# EAGLE design Linkable_LED_Matrix (EAGLE 7.0.0)
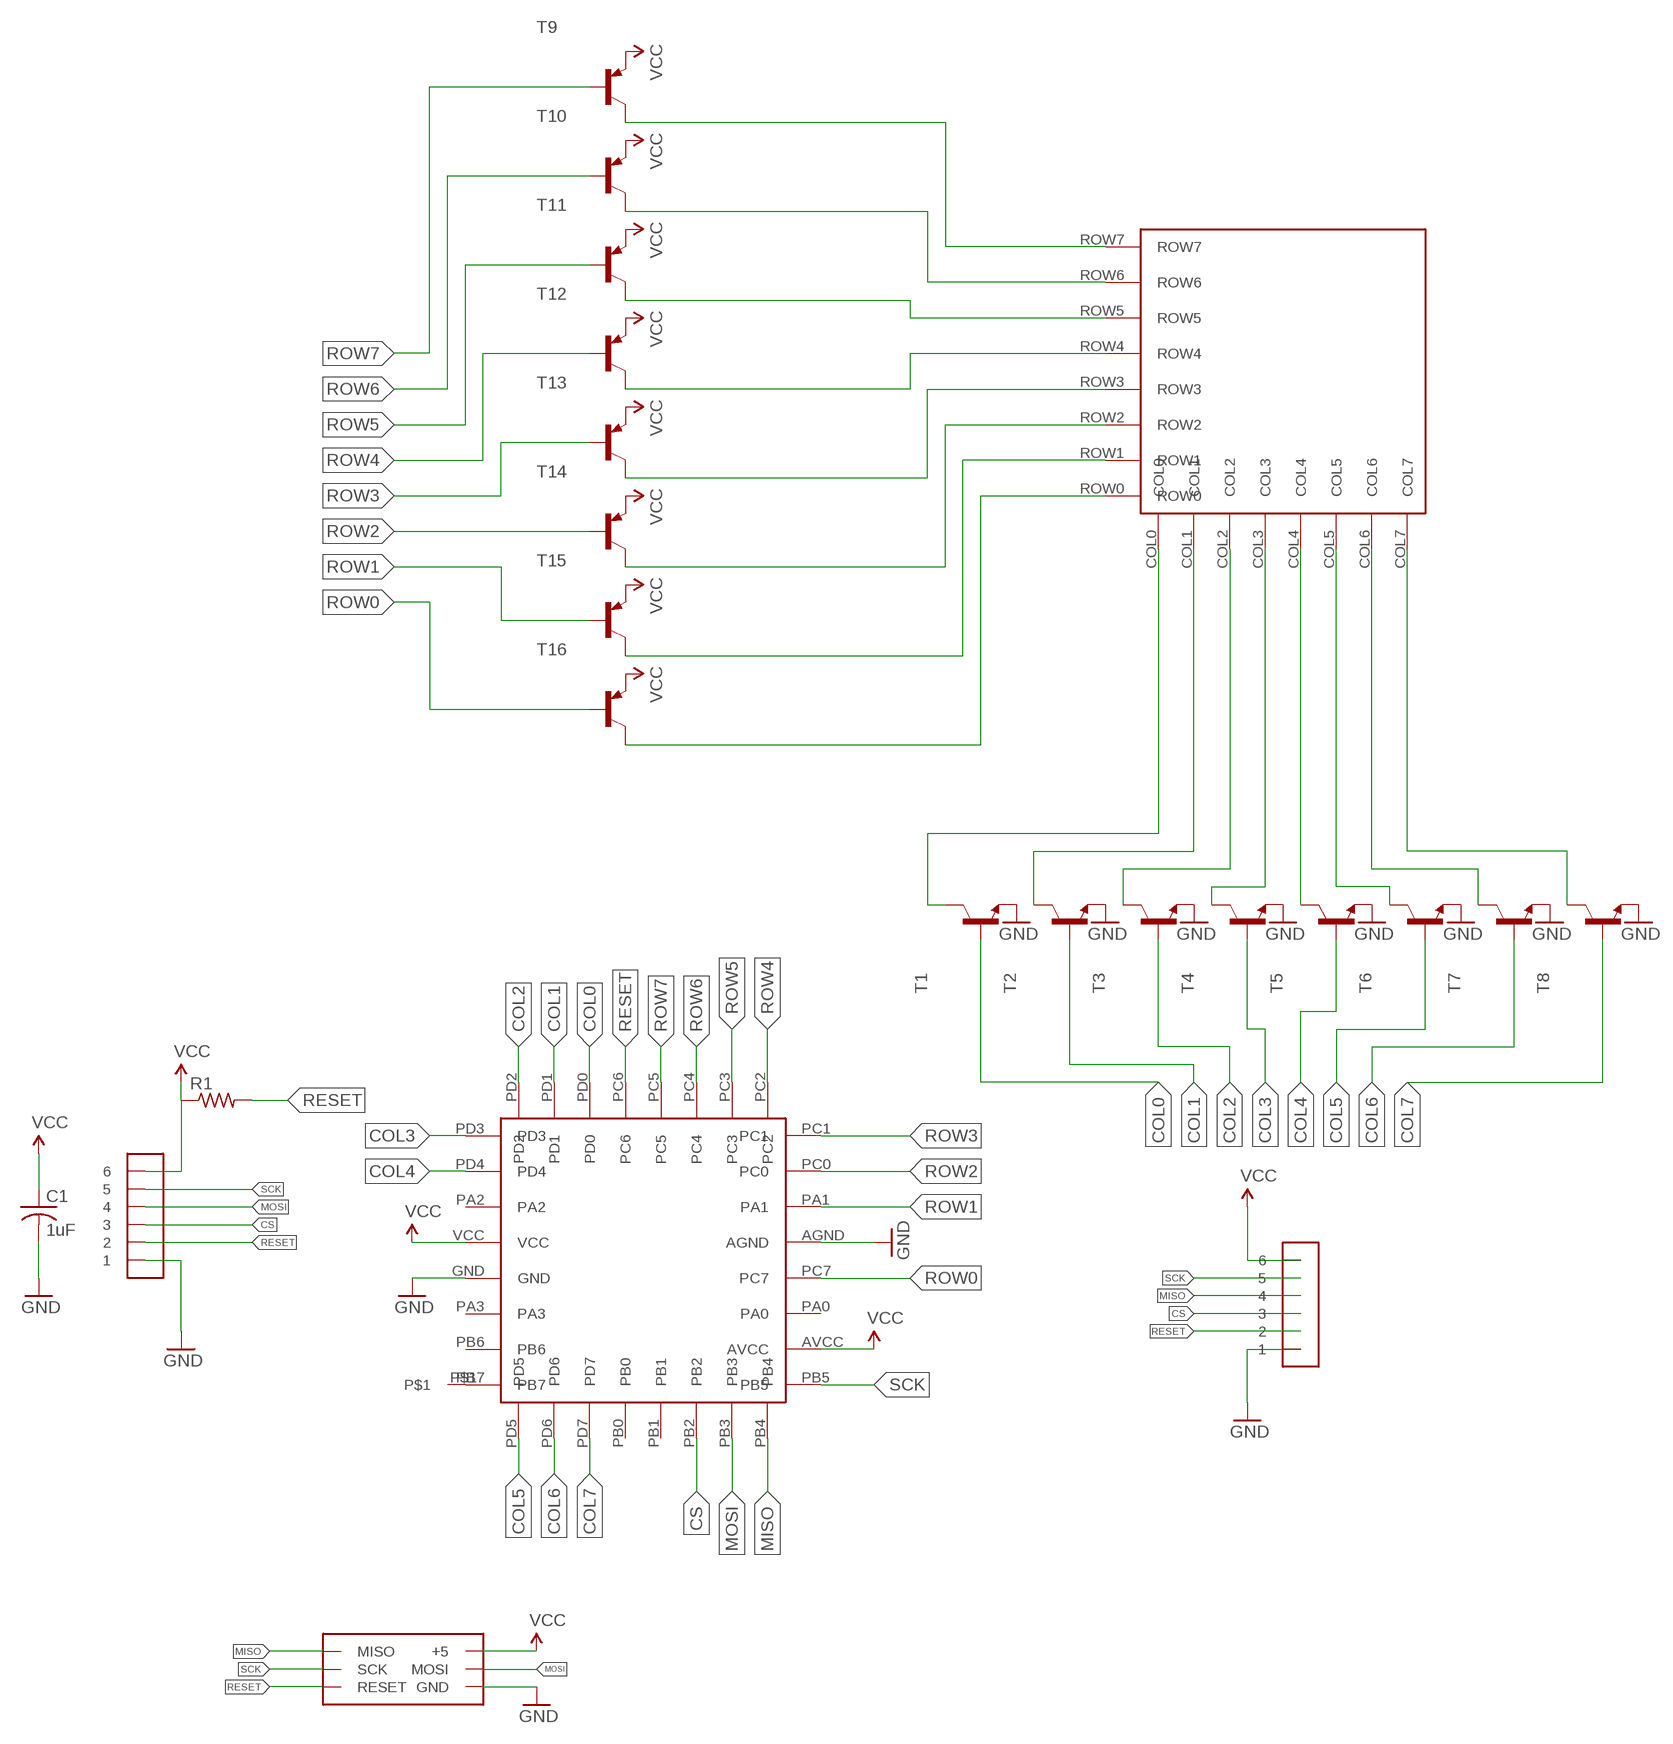
[diagram p0: schematic, sheet 1]

## Parts
C1  1uF  C-USC0603  [C0603]
R1  R-US_R0603  [R0603]
T1  MMBT2222ALT1-NPN-SOT23-BEC  [SOT23-BEC]
T2  MMBT2222ALT1-NPN-SOT23-BEC  [SOT23-BEC]
T3  MMBT2222ALT1-NPN-SOT23-BEC  [SOT23-BEC]
T4  MMBT2222ALT1-NPN-SOT23-BEC  [SOT23-BEC]
T5  MMBT2222ALT1-NPN-SOT23-BEC  [SOT23-BEC]
T6  MMBT2222ALT1-NPN-SOT23-BEC  [SOT23-BEC]
T7  MMBT2222ALT1-NPN-SOT23-BEC  [SOT23-BEC]
T8  MMBT2222ALT1-NPN-SOT23-BEC  [SOT23-BEC]
T9  MMBT3906LT1-PNP-SOT23-BEC  [SOT23-BEC]
T10  MMBT3906LT1-PNP-SOT23-BEC  [SOT23-BEC]
T11  MMBT3906LT1-PNP-SOT23-BEC  [SOT23-BEC]
T12  MMBT3906LT1-PNP-SOT23-BEC  [SOT23-BEC]
T13  MMBT3906LT1-PNP-SOT23-BEC  [SOT23-BEC]
T14  MMBT3906LT1-PNP-SOT23-BEC  [SOT23-BEC]
T15  MMBT3906LT1-PNP-SOT23-BEC  [SOT23-BEC]
T16  MMBT3906LT1-PNP-SOT23-BEC  [SOT23-BEC]
U$1  ATTINY48  [ATTINY48]
U$3  8X8_LED_MATRIX  [8X8_LED_MATRIX]
U$5  1X1MM_PAD  [1X1MM_PAD]
U$6  DIP1X6MALE  [DIP1X6MALE]
U$7  DIP1X6MALE  [DIP1X6MALE]
U$9  DIP2X3MALE  [DIP2X3MALE]

## Nets
COL0: T1.B U$1.PD0
COL1: T2.B U$1.PD1
COL2: T3.B U$1.PD2
COL3: T4.B U$1.PD3
COL4: T5.B U$1.PD4
COL5: T6.B U$1.PD5
COL6: T7.B U$1.PD6
COL7: T8.B U$1.PD7
CS: U$1.PB2 U$6.3 U$7.3
GND: C1.2 T1.E T2.E T3.E T4.E T5.E T6.E T7.E T8.E U$1.AGND U$1.GND U$6.1 U$7.1 U$9.GND
MISO: U$1.PB4 U$7.4 U$9.MISO
MOSI: U$1.PB3 U$6.4 U$9.MOSI
N$1: T1.C U$3.COL0
N$3: T3.C U$3.COL2
N$4: T4.C U$3.COL3
N$5: T5.C U$3.COL4
N$6: T6.C U$3.COL5
N$7: T7.C U$3.COL6
N$8: T8.C U$3.COL7
N$13: U$1.PB7 U$5.P$1
N$20: T2.C U$3.COL1
N$25: T9.C U$3.ROW7
N$26: T10.C U$3.ROW6
N$27: T11.C U$3.ROW5
N$28: T12.C U$3.ROW4
N$29: T13.C U$3.ROW3
N$30: T14.C U$3.ROW2
N$31: T15.C U$3.ROW1
N$32: T16.C U$3.ROW0
RESET: R1.2 U$1.PC6 U$6.2 U$7.2 U$9.RESET
ROW0: T16.B U$1.PC7
ROW1: T15.B U$1.PA1
ROW2: T14.B U$1.PC0
ROW3: T13.B U$1.PC1
ROW4: T12.B U$1.PC2
ROW5: T11.B U$1.PC3
ROW6: T10.B U$1.PC4
ROW7: T9.B U$1.PC5
SCK: U$1.PB5 U$6.5 U$7.5 U$9.SCK
VCC: C1.1 R1.1 T9.E T10.E T11.E T12.E T13.E T14.E T15.E T16.E U$1.AVCC U$1.VCC U$6.6 U$7.6 U$9.5V(+5)
Unconnected: U$1.PA0 U$1.PA2 U$1.PA3 U$1.PB0 U$1.PB1 U$1.PB6

## Library data of the parts
C1 = resistor:C-US: CAPACITOR, American symbol
R1 = resistor:R-US_: RESISTOR, American symbol
T1-T8 = transistor:*-NPN-: NPN Transistror BF959 corrected 2008.03.06
T9-T16 = transistor:*-PNP-: PNP Transistror
U$1 = ScottSilver:ATTINY48
U$3 = ScottSilver:8X8_LED_MATRIX
U$5 = ScottSilver:1X1MM_PAD
U$6 U$7 = ScottSilver:DIP1X6MALE
U$9 = ScottSilver:DIP2X3MALE

## Board
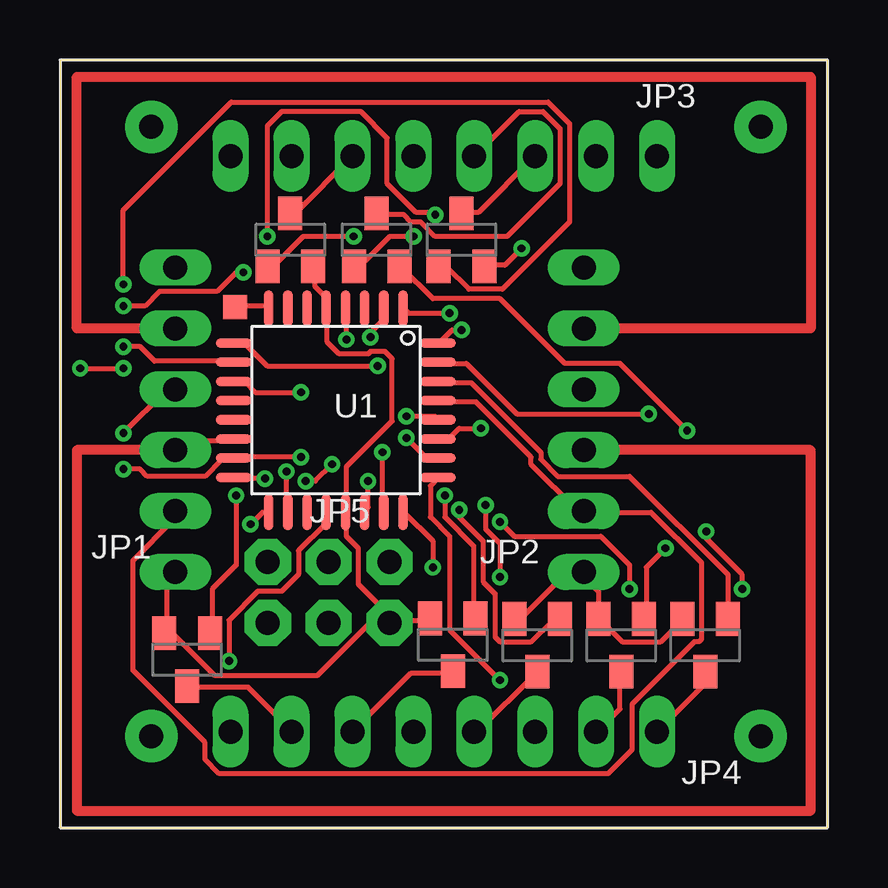
[diagram p1: board, top side]
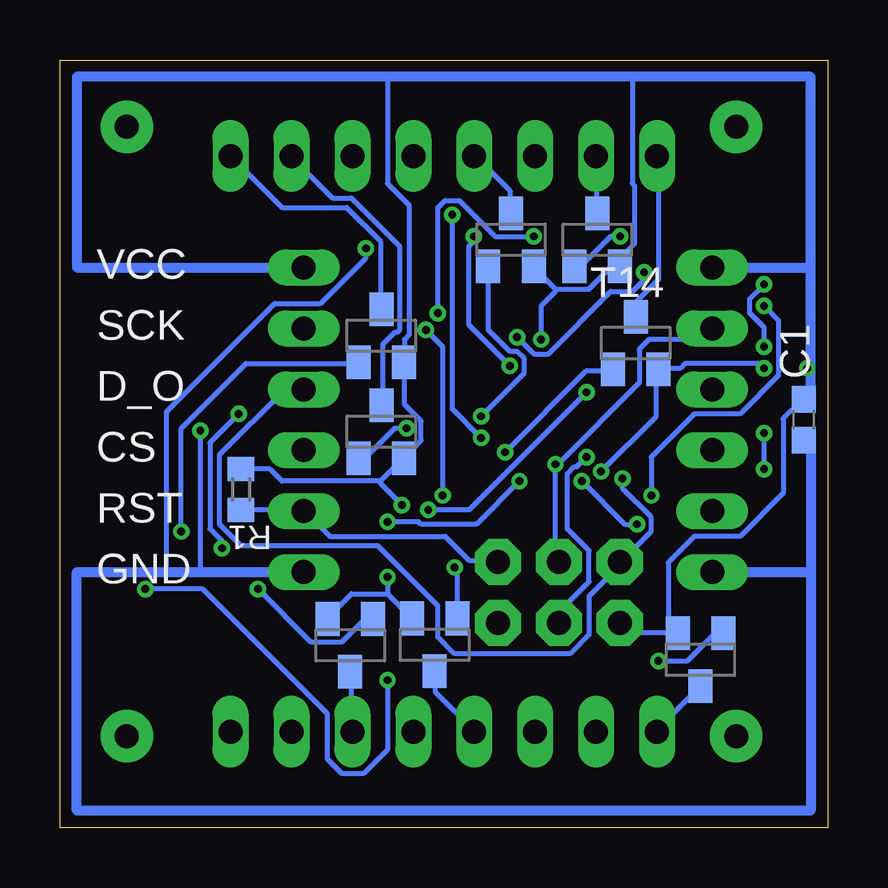
[diagram p2: board, bottom side, seen from below]

Size 32 x 32 mm. Coordinates in mm from the lower left corner, seen from the top.
Outline: 0,0 32,0 32,32 0,32 0,0
Copper layers (1*16): Top 0.0356mm / dielectric 1.5011mm / Bottom 0.0356mm
Design rules "LaenPCBOrder *": minimum track width 8mil, minimum drill 13mil, track to track 6mil, track to pad 6mil, pad to pad 6mil, via to via 6mil, smd to smd 6mil, copper to edge 15mil, drill to drill 6mil, minimum pad ring 7mil, minimum via ring 7mil, stop-mask expansion 3mil, vias tented up to drill 0mil, thermal gap 10mil
vRestrict: area 6.2,26.4 to 25.7,29.6; area 6.2,2.5 to 25.8,5.6; area 20.4,9.8 to 23.3,24.1; area 7.2,7.3 to 15.2,12.3; area 3,9 to 7,25

### Footprints (pad centres in the part's own frame; a part is rotated, then mirrored left to right if it is on the bottom)
C0603 = smd 1.1 x 1: 1 -0.85,0; 2 0.85,0
R0603 = smd 1 x 1.1: 1 -0.85,0; 2 0.85,0
SOT23-BEC = smd 1 x 1.4: B -0.95,-1.1; C 0,1.1; E 0.95,-1.1
ATTINY48 = smd 1.5 x 0.406: AGND 4.25,0.4; AVCC 4.25,-2; GND -4.25,-0.4; PA0 4.25,-1.2; PA1 4.25,1.2; PA2 -4.25,1.2; PA3 -4.25,-1.2; PB5 4.25,-2.8; PB6 -4.25,-2; PB7 -4.25,-2.8; PC0 4.25,2; PC1 4.25,2.8; PC7 4.25,-0.4; PD3 -4.25,2.8; PD4 -4.25,2; VCC -4.25,0.4 | smd 0.406 x 1.5: PB0 -0.4,-4.25; PB1 0.4,-4.25; PB2 1.2,-4.25; PB3 2,-4.25; PB4 2.8,-4.25; PC2 2.8,4.25; PC3 2,4.25; PC4 1.2,4.25; PC5 0.4,4.25; PC6 -0.4,4.25; PD0 -1.2,4.25; PD1 -2,4.25; PD2 -2.8,4.25; PD5 -2.8,-4.25; PD6 -2,-4.25; PD7 -1.2,-4.25
8X8_LED_MATRIX = drill 1 long: COL0 8.89,-12; COL1 6.35,-12; COL2 -3.81,-12; COL3 -3.81,12; COL4 -6.35,-12; COL5 1.27,12; COL6 3.81,12; COL7 1.27,-12; ROW0 -8.89,-12; ROW1 3.81,-12; ROW2 -8.89,12; ROW3 -1.27,-12; ROW4 8.89,12; ROW5 -6.35,12; ROW6 6.35,12; ROW7 -1.27,12
1X1MM_PAD = smd 1 x 1: P$1 0,0
DIP1X6MALE = drill 1 long: 1 -6.35,0; 2 -3.81,0; 3 -1.27,0; 4 1.27,0; 5 3.81,0; 6 6.35,0
DIP2X3MALE = drill 1 pad 1.93 octagon: 5V -2.54,1.27; GND 2.54,1.27; MISO -2.54,-1.27; MOSI 0,1.27; RESET 2.54,-1.27; SCK 0,-1.27

### Placement (x,y rotation side)
C1  1,17 270 bottom
R1  24.45,14.1 270 bottom
T1  26.9,7.6 180 top
T2  23.4,7.6 180 top
T3  16.38,7.62 180 top
T4  9.6,24.5 0 top
T5  5.3,7 180 top
T6  13.2,24.5 0 top
T7  16.74,24.5 0 top
T8  19.9,7.6 180 top
T9  13.2,24.5 0 bottom
T10  18.6,16.5 0 bottom
T11  9.6,24.5 0 bottom
T12  18.6,20.5 0 bottom
T13  16.38,7.62 180 bottom
T14  8,20.2 0 bottom
T15  19.9,7.6 180 bottom
T16  5.3,7 180 bottom
U$1  11.5,17.4 270 top
U$3  16,16 0 top
U$5  7.3,21.7 0 top
U$6  4.81,17 90 top
U$7  21.84,17 90 top
U$9  11.2,9.8 180 bottom

### Tracks (layer width: path | path; a pad name or v marks a point on that pad's centre or on a via)
COL0
  Top 0.203: T1.B 27.84,8.74 27.84,10.54 23.74,14.64 20.74,14.64 20.04,15.34 20.04,15.64 17.14,18.54 15.84,18.54 U$1.PD0
COL1  (via drill 0.33)
  Top 0.203: v25.24,11.64 24.44,10.84 24.44,8.74 T2.B | v24.54,17.24 19.04,17.24 16.94,19.34 15.84,19.34 U$1.PD1
  Bottom 0.203: v25.24,11.64 25.24,11.94 25.74,12.44 25.74,16.04 v24.54,17.24
COL2  (via drill 0.33)
  Top 0.203: v16.04,13.84 16.04,12.94 17.24,11.74 17.24,8.74 T3.B | v16.74,20.74 16.34,20.74 15.84,20.24 U$1.PD2
  Bottom 0.203: v16.04,13.84 16.04,20.04 v16.74,20.74
COL3  (via drill 0.33)
  Top 0.203: v12.24,24.64 10.14,24.64 8.94,23.44 8.74,23.44 T4.B | v16.24,21.44 14.54,21.44 14.34,21.64 U$1.PD3
  Bottom 0.203: v12.24,24.64 13.84,24.64 15.34,26.14 15.94,26.14 16.24,25.84 v16.24,21.44
COL4  (via drill 0.33)
  Top 0.203: v7.34,13.84 7.34,10.94 6.34,9.94 6.34,8.14 T5.B | v2.64,21.74 3.54,21.74 4.14,22.34 6.54,22.34 7.34,23.14 v7.64,23.14 | v12.94,20.44 12.94,20.64 13.44,21.14 13.44,21.64 U$1.PD4
  Bottom 0.203: v7.34,13.84 7.34,15.44 5.54,17.24 3.64,17.24 2.04,18.84 2.04,21.14 v2.64,21.74 | v7.64,23.14 7.64,22.84 8.14,22.34 9.04,22.34 11.64,19.74 12.24,19.74 v12.94,20.44
COL5  (via drill 0.33)
  Top 0.203: v14.74,24.64 13.74,24.64 12.54,23.44 12.34,23.44 T6.B | v13.24,19.24 8.64,19.24 7.74,20.14 7.34,20.14 U$1.PD5
  Bottom 0.203: v14.74,24.64 14.74,24.44 14.94,24.24 14.94,20.94 v13.24,19.24
COL6  (via drill 0.33)
  Top 0.203: v2.64,22.64 2.64,25.74 7.14,30.24 20.34,30.24 21.24,29.34 21.24,25.24 18.44,22.44 17.04,22.44 16.14,23.34 15.84,23.34 T7.B | v2.64,20.04 3.34,20.04 3.94,19.44 7.24,19.44 U$1.PD6
  Bottom 0.203: v2.64,22.64 3.24,22.04 3.24,21.44 2.64,20.84 v2.64,20.04
COL7  (via drill 0.33)
  Top 0.203: v16.64,13.24 16.64,12.94 17.64,11.94 17.64,10.24 18.14,9.74 18.14,7.94 18.34,7.74 19.64,7.74 20.54,8.64 20.84,8.64 T8.B | v10.04,18.14 8.14,18.14 7.74,18.54 7.34,18.54 U$1.PD7
  Bottom 0.203: v16.64,13.24 14.94,13.24 v10.04,18.14
CS
  Top 0.203: U$1.PB2 7.24,16.14 5.24,16.14 4.94,15.84 U$6.3
  Top 0.406: U$6.3 0.7,15.73 0.7,0.7 31.3,0.7 31.3,15.73 U$7.3
GND  (via drill 0.33)
  Top 0.203: T4.E 10.64,23.34 10.64,22.54 11.04,22.14 11.04,21.74 U$1.GND 11.14,21.64 11.14,20.24 11.64,19.74 12.84,19.74 12.94,19.84 13.54,19.84 13.84,19.54 13.84,16.94 11.94,15.04 11.94,13.24 U$1.AGND 11.94,13.14 11.94,12.14 12.44,11.64 12.44,10.14 13.84,8.74 U$9.GND | T3.E 15.34,8.64 13.84,8.64 13.74,8.54 U$9.GND | U$6.1 4.74,10.64 4.44,10.34 4.44,8.14 T5.E 4.54,8.24 6.44,6.34 10.74,6.34 12.84,8.44 13.64,8.44 U$9.GND | T8.E 19.04,8.74 19.24,8.74 21.14,10.64 21.74,10.64 U$7.1 21.74,10.54 22.44,9.84 22.44,8.74 T2.E 22.54,8.64 23.44,7.74 25.04,7.74 25.94,8.64 T1.E | v26.14,16.54 23.34,19.34 21.04,19.34 18.34,22.04 15.54,22.04 14.24,23.34 T6.E | v19.24,24.14 18.54,23.44 17.74,23.44 T7.E
  Bottom 0.203: 26.14,10.65 v26.14,16.54 | v19.24,24.14 19.24,23.74 21.14,21.84 23.04,21.84 27.54,17.34 27.54,10.65
  Bottom 0.406: U$6.1 0.7,10.65 | 0.7,10.65 0.7,0.7 31.3,0.7 31.3,10.65 27.54,10.65 26.14,10.65 U$7.1 | C1.2 arc90 0.7,15.85 0.7,10.65
MISO  (via drill 0.33)
  Top 0.203: v8.54,14.54 7.34,14.54 U$1.PB4
  Bottom 0.203: v8.54,14.54 8.54,14.14 7.34,12.94 7.34,12.34 8.64,11.04 U$9.MISO 8.64,10.94 9.94,9.64 9.94,8.04 10.74,7.24 15.54,7.24 16.24,7.94 16.24,9.24 18.74,11.74 24.44,11.74 25.34,12.64 25.34,15.54 22.64,18.24 21.84,18.24 U$7.4
MOSI  (via drill 0.33)
  Top 0.203: v10.04,15.44 7.34,15.44 U$1.PB3 7.24,15.34 6.74,15.34 6.04,14.64 3.64,14.64 3.34,14.94 v2.64,14.94 | v2.64,16.44 4.44,18.24 4.74,18.24 U$6.4
  Bottom 0.203: v10.04,15.44 10.44,15.04 10.54,15.04 10.84,14.74 10.84,12.44 9.94,11.54 9.94,10.24 11.14,9.04 11.14,8.54 U$9.MOSI | v2.64,14.94 v2.64,16.44
N$1
  Top 0.203: T1.C 26.84,6.44 26.84,5.94 24.94,4.04 U$3.COL0
N$3
  Top 0.203: T3.C 16.34,6.44 14.64,6.44 12.24,4.04 U$3.COL2
N$4
  Top 0.203: T4.C 9.64,25.64 9.84,25.64 12.14,27.94 U$3.COL3
N$5
  Top 0.203: T5.C 5.34,5.84 7.84,5.84 9.64,4.04 U$3.COL4
N$6
  Top 0.203: T6.C 13.24,25.54 14.34,25.54 14.64,25.24 15.04,25.24 15.64,24.64 18.64,24.64 20.84,26.84 20.84,29.14 20.14,29.84 19.14,29.84 17.34,28.04 U$3.COL5
N$7
  Top 0.203: T7.C 16.74,25.64 17.44,25.64 19.74,27.94 U$3.COL6
N$8
  Top 0.203: T8.C 17.34,3.94 U$3.COL7
N$9  (via drill 1 pad 2.18)
  other vias: 3.81,29.21
N$10  (via drill 1 pad 2.18)
  other vias: 3.81,3.81
N$11  (via drill 1 pad 2.18)
  other vias: 29.21,29.21
N$12  (via drill 1 pad 2.18)
  other vias: 29.21,3.81
N$13
  Top 0.203: U$5.P$1 7.34,21.74 8.64,21.74 U$1.PB7
N$20
  Top 0.203: T2.C 23.34,6.44 23.34,4.94 22.44,4.04 U$3.COL1
N$25
  Bottom 0.203: T9.C 13.24,25.64 13.24,26.54 14.64,27.94 U$3.ROW7
N$26
  Bottom 0.203: T10.C 18.54,17.64 18.54,20.14 18.04,20.64 17.94,20.64 17.84,20.74 17.84,24.24 19.84,26.24 20.64,26.24 22.34,27.94 U$3.ROW6
N$27
  Bottom 0.203: T11.C 9.64,25.64 9.64,27.94 U$3.ROW5
N$28
  Bottom 0.203: T12.C 18.64,21.64 18.64,24.44 20.04,25.84 22.74,25.84 24.84,27.94 U$3.ROW4
N$29
  Bottom 0.203: T13.C 16.34,6.44 16.34,5.64 14.74,4.04 U$3.ROW3
N$30
  Bottom 0.203: T14.C 7.94,21.34 7.94,21.94 7.04,22.84 7.04,27.94 U$3.ROW2
N$31
  Bottom 0.203: T15.C 19.84,6.44 19.84,4.04 U$3.ROW1
N$32
  Bottom 0.203: T16.C 5.34,5.84 7.14,4.04 U$3.ROW0
RESET
  Top 0.203: U$1.PC6 15.84,17.74 17.34,17.74 19.64,15.44 19.64,15.14 21.54,13.24 21.74,13.24 U$7.2 21.84,13.14 24.64,13.14 26.74,11.04 26.74,7.84 26.64,7.74 26.44,7.74 23.84,5.14 23.84,3.24 22.84,2.24 6.64,2.24 6.04,2.84 6.04,3.54 3.04,6.54 3.04,11.14 4.74,12.84 4.74,13.14 U$6.2
  Bottom 0.203: R1.2 21.84,13.24 U$7.2 21.74,13.14 20.74,12.14 15.94,12.14 14.94,11.14 13.74,11.14 U$9.RESET
ROW0  (via drill 0.33)
  Top 0.203: v7.04,6.94 7.04,8.64 8.24,9.84 9.24,9.84 9.94,10.54 9.94,11.54 11.04,12.64 11.04,13.14 U$1.PC7
  Bottom 0.203: v7.04,6.94 5.84,6.94 4.74,8.04 4.44,8.04 T16.B
ROW1  (via drill 0.33)
  Top 0.203: v23.74,9.94 23.74,10.94 22.54,12.14 18.94,12.14 v18.34,12.74 | v12.84,14.44 12.84,13.34 12.74,13.24 U$1.PA1
  Bottom 0.203: v23.74,9.94 21.54,7.74 20.24,7.74 19.34,8.64 19.04,8.64 T15.B | v18.34,12.74 17.04,12.74 16.94,12.64 14.64,12.64 v12.84,14.44
ROW2  (via drill 0.33)
  Top 0.203: v13.44,15.64 13.44,13.24 U$1.PC0
  Bottom 0.203: v13.44,15.64 10.04,19.04 9.04,19.04 T14.B
ROW3  (via drill 0.33)
  Top 0.203: v15.54,10.84 15.54,11.94 14.34,13.14 U$1.PC1
  Bottom 0.203: v15.54,10.84 15.44,10.74 15.44,8.74 T13.B
ROW4  (via drill 0.33)
  Top 0.203: v26.94,12.34 26.94,12.04 28.44,10.54 v28.44,9.94 | v18.34,6.14 16.24,8.24 16.24,12.14 15.44,12.94 15.44,14.24 15.74,14.54 U$1.PC2
  Bottom 0.203: v26.94,12.34 26.94,16.64 24.24,19.34 19.64,19.34 T12.B | v28.44,9.94 26.04,9.94 20.84,4.74 20.84,2.84 20.24,2.24 19.34,2.24 18.34,3.24 v18.34,6.14
ROW5  (via drill 0.33)
  Top 0.203: v8.64,24.64 8.64,29.24 9.24,29.84 12.54,29.84 13.64,28.74 13.64,26.84 14.84,25.64 15.54,25.64 v15.64,25.54 | v14.44,16.24 15.24,15.44 15.74,15.44 U$1.PC3
  Bottom 0.203: v8.64,24.64 9.04,24.64 10.24,23.44 10.54,23.44 T11.B | v15.64,25.54 15.64,17.44 v14.44,16.24
ROW6  (via drill 0.33)
  Top 0.203: v17.54,16.64 16.64,16.64 16.24,16.24 15.84,16.24 U$1.PC4
  Bottom 0.203: v17.54,16.64 18.04,16.64 19.24,15.44 19.54,15.44 T10.B
ROW7  (via drill 0.33)
  Top 0.203: v14.44,17.14 15.64,17.14 15.74,17.04 U$1.PC5
  Bottom 0.203: v14.44,17.14 12.64,18.94 12.64,19.54 12.94,19.84 13.24,19.84 14.14,20.74 14.14,23.34 T9.B
SCK  (via drill 0.33)
  Top 0.203: v7.94,12.64 8.44,13.14 8.64,13.14 U$1.PB5 | v10.24,14.44 10.64,14.44 v11.34,15.14
  Top 0.406: U$6.5 0.7,20.81 0.7,31.3 31.3,31.3 31.3,20.81 U$7.5
  Bottom 0.203: v7.94,12.64 8.44,12.64 v10.24,14.44 | U$9.SCK 11.24,11.14 11.34,11.24 v11.34,15.14 11.24,15.14 7.84,18.54 7.84,19.94 7.44,20.34 5.24,20.34 4.84,20.74 U$6.5
VCC  (via drill 0.33)
  Top 0.203: v18.34,10.44 18.34,11.84 17.74,12.44 v17.74,13.44 | v9.44,14.84 9.44,13.24 U$1.AVCC | v11.94,20.34 11.94,21.64 U$1.VCC | v0.84,19.14 v2.64,19.14
  Bottom 0.203: 18.34,9.74 17.34,8.74 T13.E | 18.34,9.74 19.84,9.74 20.84,8.74 T15.E | 18.64,14.44 22.74,14.44 23.24,14.94 R1.1 | 18.64,14.44 17.74,15.34 T10.E 17.64,15.44 16.94,16.14 16.94,16.94 17.64,17.64 17.64,19.34 T12.E 17.64,19.44 17.64,20.34 17.44,20.54 17.44,25.94 18.34,26.84 18.34,31.3 | v18.34,10.44 18.34,9.74 | v17.74,13.44 18.64,14.34 18.64,14.44 | v9.44,14.84 7.14,17.14 7.14,19.04 T14.E 7.04,19.14 6.14,19.14 5.94,19.34 2.84,19.34 v2.64,19.14 | U$9.5V 8.64,8.44 8.34,8.14 6.34,8.14 T16.E 6.64,8.24 6.64,11.04 5.54,12.14 3.64,12.14 1.84,13.94 1.84,17.04 1.14,17.74 C1.1 | 11.34,22.44 9.94,22.44 9.04,23.34 8.74,23.34 T11.E 8.64,23.44 8.64,23.74 8.04,24.34 8.04,26.74 8.14,26.84 8.14,31.3 | 11.34,22.44 12.24,23.34 T9.E | v11.94,20.34 11.94,21.74 11.34,22.34 11.34,22.44 | v0.84,19.14 0.7,19.14
  Bottom 0.406: U$6.6 0.7,23.35 | 0.7,23.35 0.7,31.3 8.14,31.3 18.34,31.3 31.3,31.3 31.3,23.35 U$7.6 | C1.1 arc-90 0.7,18.15 0.7,19.14 0.7,23.35

### Text on the board
tPlace: JP3 | U1 | JP5 | JP1 | JP2 | JP4
bPlace: VCC | SCK | D_O | CS | R1 | RST | GND